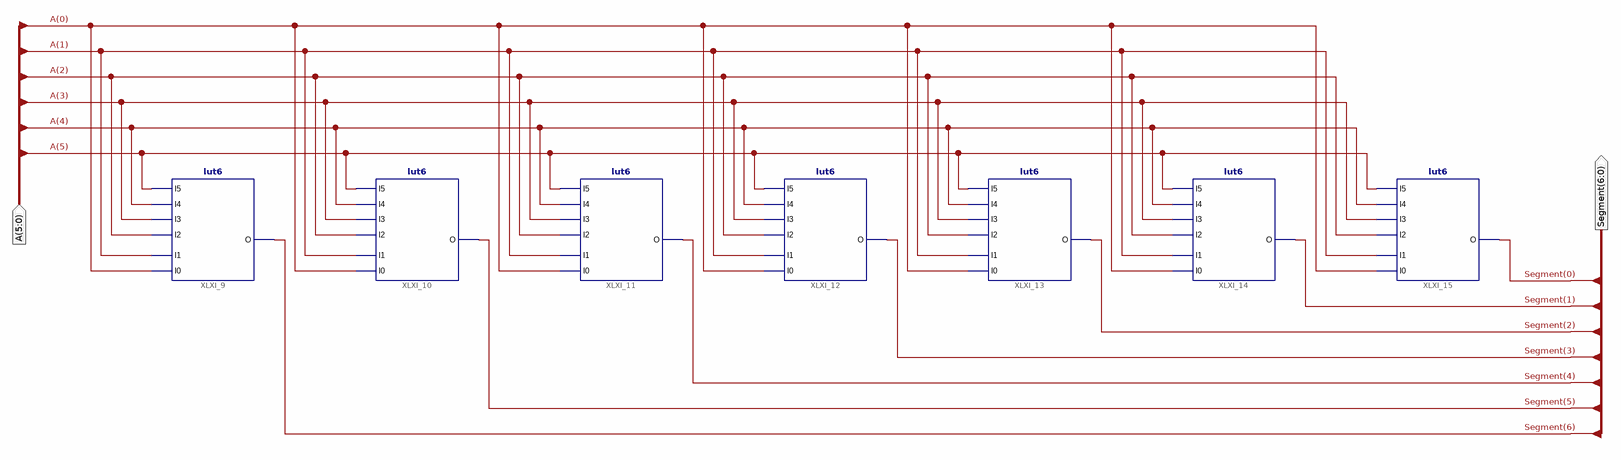
[diagram p0: schematic sheet 1]
// Xilinx ISE schematic ssd1d_a9.sch (spartan6) as structural Verilog: 7 symbols, 2 ports
module ssd1d_a9 (
  input  [5:0] A,
  output [6:0] Segment
);

  lut6 #(.INIT("0000001BE71B09F6")) XLXI_9 (
    .O(Segment[6]), .I0(A[0]), .I1(A[1]), .I2(A[2]), .I3(A[3]), .I5(A[5]), .I4(A[4]));
  lut6 #(.INIT("0000001B8ABFD9EE")) XLXI_10 (
    .O(Segment[5]), .I0(A[0]), .I1(A[1]), .I2(A[2]), .I3(A[3]), .I5(A[5]), .I4(A[4]));
  lut6 #(.INIT("0000000A2C75F97E")) XLXI_11 (
    .O(Segment[4]), .I0(A[0]), .I1(A[1]), .I2(A[2]), .I3(A[3]), .I5(A[5]), .I4(A[4]));
  lut6 #(.INIT("0000001B6EF894BC")) XLXI_12 (
    .O(Segment[3]), .I0(A[0]), .I1(A[1]), .I2(A[2]), .I3(A[3]), .I5(A[5]), .I4(A[4]));
  lut6 #(.INIT("0000001FDB6AE796")) XLXI_13 (
    .O(Segment[2]), .I0(A[0]), .I1(A[1]), .I2(A[2]), .I3(A[3]), .I5(A[5]), .I4(A[4]));
  lut6 #(.INIT("0000001CFFA3C792")) XLXI_14 (
    .O(Segment[1]), .I0(A[0]), .I1(A[1]), .I2(A[2]), .I3(A[3]), .I5(A[5]), .I4(A[4]));
  lut6 #(.INIT("0000001F6C0FE0EA")) XLXI_15 (
    .O(Segment[0]), .I0(A[0]), .I1(A[1]), .I2(A[2]), .I3(A[3]), .I5(A[5]), .I4(A[4]));
endmodule
